# EAGLE design PD_FDS100_v1_0 (EAGLE 6.5.0)
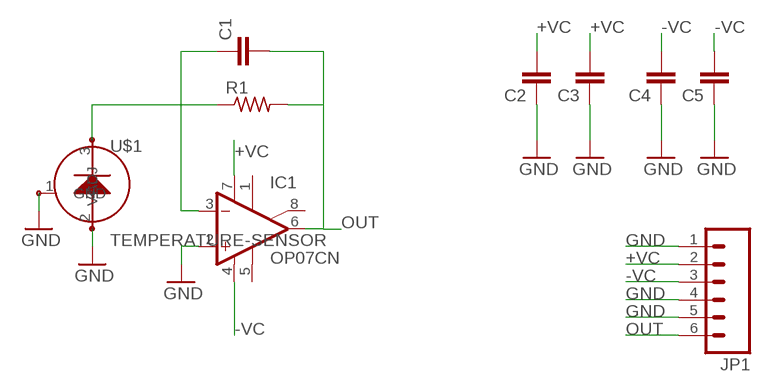
[diagram p0: schematic, sheet 1]

## Parts
C1  CAPPTH1  [CAP-PTH-5MM]
C2  CAPPTH1  [CAP-PTH-5MM]
C3  CAPPTH1  [CAP-PTH-5MM]
C4  CAPPTH1  [CAP-PTH-5MM]
C5  CAPPTH1  [CAP-PTH-5MM]
IC1  OP07CN  [DIL08]
JP1  M06NO_SILK  [1X06_NO_SILK]
R1  R-US_0207/10  [0207/10]
U$1  TEMPERATURE-SENSOR  [TO-92]

## Nets
+VC: C2.2 C3.2 IC1.7(V+) JP1.2
-VC: C4.2 C5.2 IC1.4(V-) JP1.3
GND: C2.1 C3.1 C4.1 C5.1 IC1.2(-IN) JP1.1 JP1.4 JP1.5 U$1.1(GND) U$1.2(ADJ)
N$1: C1.1 IC1.3(+IN) R1.1 U$1.3(VCC)
OUT: C1.2 IC1.6(OUT) JP1.6 R1.2
Unconnected: IC1.1(ON1) IC1.5(OPT) IC1.8(ON2)

## Library data of the parts
C1-C5 = SparkFun-Capacitors:CAP: Capacitor Standard 0603 ceramic capacitor, and 0.1" leaded capacitor.
IC1 = linear:OP07*: OP AMP
JP1 = SparkFun-Connectors:M06: Header 6 Standard 6-pin 0.1" header. Use with straight break away headers (SKU : PRT-00116), right angle break away headers (PRT-00553), swiss pins (PRT-00743), machine pins (PRT-00117), and female headers (PRT-00115). Molex polarized connector foot print use with SKU : PRT-08094 with associated crimp pins and housings. NOTES ON THE VARIANTS LOCK and LOCK_LONGPADS... This footprint was designed to help hold the alignment of a through-hole component (i.e. 6-pin header) while soldering it into place. You may notice that each hole has been shifted either up or down by 0.005 of an inch from it's more standard position (which is a perfectly straight line). This slight alteration caused the pins (the squares in the middle) to touch the edges of the holes. Because they are alternating, it causes a "brace" to hold the component in place. 0.005 has proven to be the perfect amount of "off-center" position when using our standard breakaway headers. Although looks a little odd when you look at the bare footprint, once you have a header in there, the alteration is very hard to notice. Also,if you push a header all the way into place, it is covered up entirely on the bottom side. This idea of altering the position of holes to aid alignment will be further integrated into the Sparkfun Library for other footprints. It can help hold any component with 3 or more connection pins.
R1 = adafruit:R-US_: RESISTOR, American symbol
U$1 = SparkFun-Sensors:TEMPERATURE-SENSOR: TO-92 temp sensor

## Board
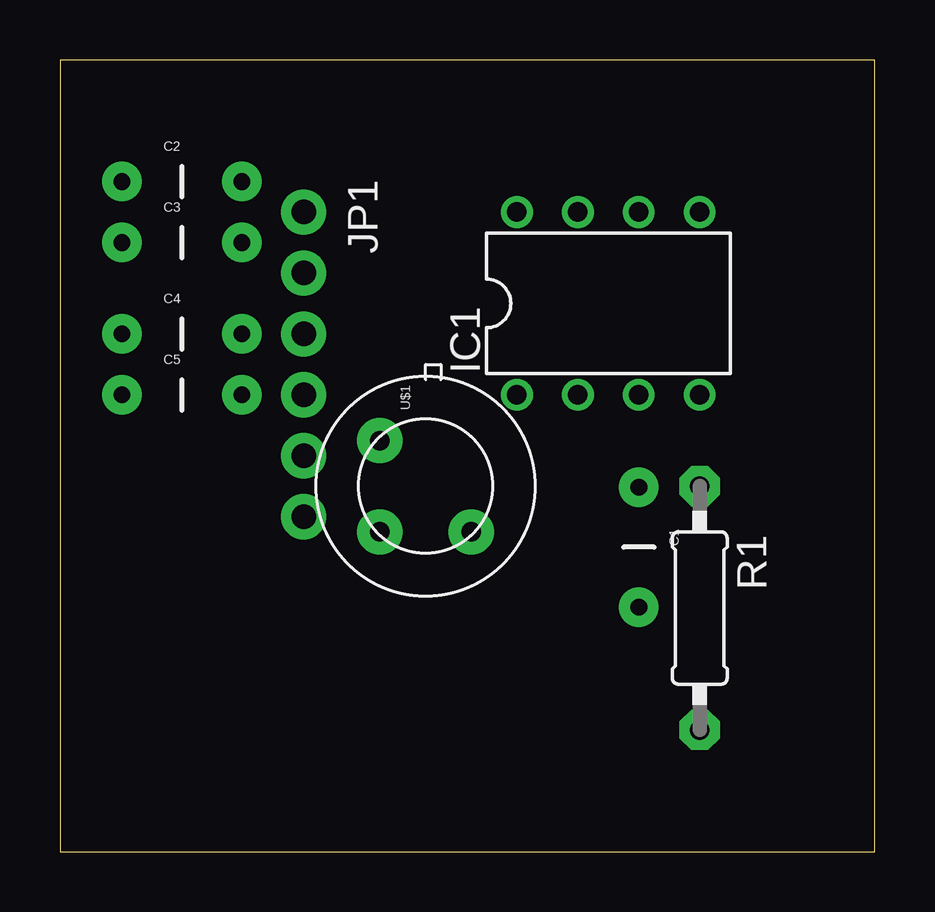
[diagram p1: board, top side]
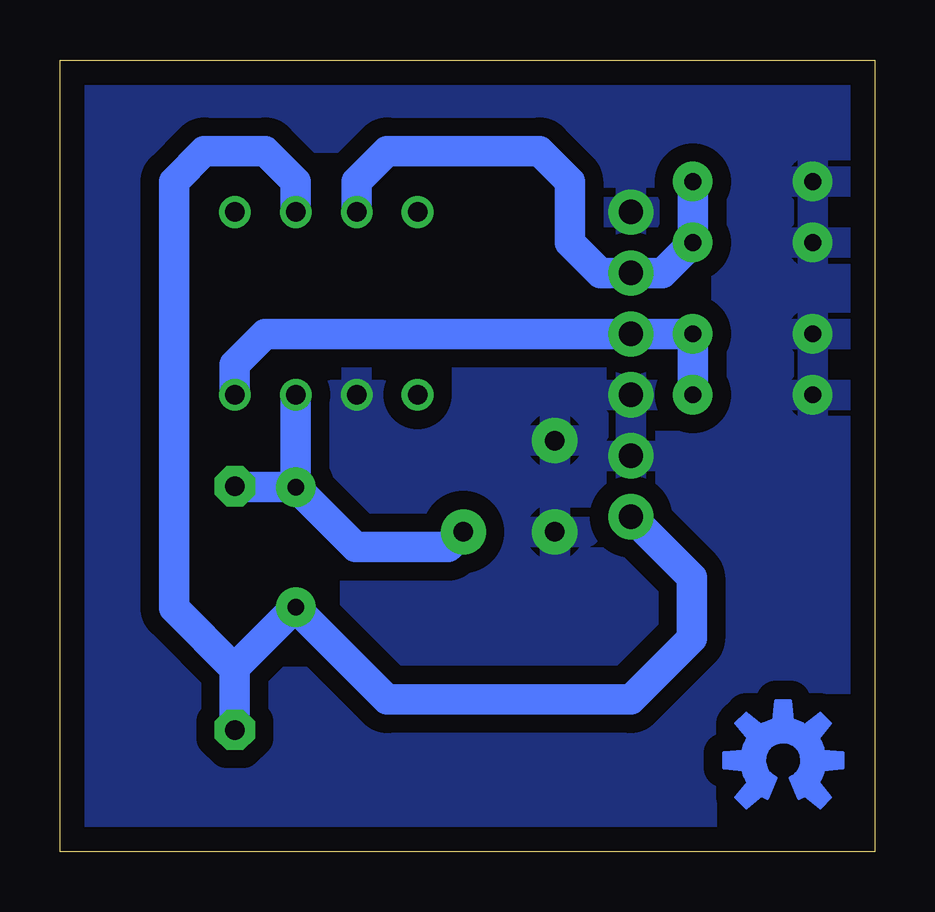
[diagram p2: board, bottom side, seen from below]

Size 33.96 x 33.01 mm. Coordinates in mm from the lower left corner, seen from the top.
Outline: 0,0 33.96,0 33.96,33.01 0,33.01 0,0
Copper layers (1*16): Top 0.035mm / dielectric 1.5mm / Bottom 0.035mm
Design rules "default": minimum track width 10mil, minimum drill 24mil, track to track 8mil, track to pad 8mil, pad to pad 8mil, via to via 8mil, smd to smd 8mil, copper to edge 40mil, drill to drill 8mil, minimum pad ring 10mil, minimum via ring 8mil, stop-mask expansion 4mil, vias tented up to drill 0mil, thermal gap 10mil

### Footprints (pad centres in the part's own frame; a part is rotated, then mirrored left to right if it is on the bottom)
CAP-PTH-5MM = drill 0.7 pad 1.651: 1 -2.5,0; 2 2.5,0
DIL08 = drill 0.813 pad 1.27: 1 -3.81,-3.81; 2 -1.27,-3.81; 3 1.27,-3.81; 4 3.81,-3.81; 5 3.81,3.81; 6 1.27,3.81; 7 -1.27,3.81; 8 -3.81,3.81
1X06_NO_SILK = drill 1.016 pad 1.88: 1 0,0; 2 2.54,0; 3 5.08,0; 4 7.62,0; 5 10.16,0; 6 12.7,0
0207/10 = drill 0.813 pad 1.676 octagon: 1 -5.08,0; 2 5.08,0
TO-92 = drill 0.813 pad 1.88: 1 -1.905,1.905; 2 1.905,1.905; 3 -1.905,-1.905

### Placement (x,y rotation side)
C1  24.13,12.7 270 top
C2  5.08,27.94 0 top
C3  5.08,25.4 0 top
C4  5.08,21.59 0 top
C5  5.08,19.05 0 top
IC1  22.86,22.86 0 top
JP1  10.16,26.67 270 top
R1  26.67,10.16 270 top
U$1  15.24,15.24 90 top
U$2  [OSHW-LOGO-M]  3.81,3.81 0 top

### Tracks (layer width: path | path; a pad name or v marks a point on that pad's centre or on a via)
+VC
  Bottom 1.27: C2.2 C3.2 8.85,24.13 JP1.2 11.43,24.13 12.7,25.4 12.7,27.94 13.97,29.21 20.32,29.21 21.59,27.94 IC1.7
-VC
  Bottom 1.27: IC1.4 26.67,20.32 25.4,21.59 JP1.3 C4.2 C5.2
GND
  pour Bottom (isolate 0.762): 0,33.02 0,0 34.29,0 34.29,33.02
N$1
  Bottom 1.27: IC1.3 C1.1 | 24.17,15.2 C1.1 | R1.1 26.63,15.2 C1.1 | C1.1 21.63,12.7 17.78,12.7 U$1.3
OUT
  Bottom 1.27: 26.67,7.62 R1.2 | 26.67,7.62 26.67,7.66 C1.2 24.13,10.16 20.32,6.35 10.16,6.35 7.62,8.89 7.62,11.43 JP1.6 | 26.67,7.62 29.21,10.16 29.21,27.94 27.94,29.21 25.4,29.21 24.13,27.94 IC1.6